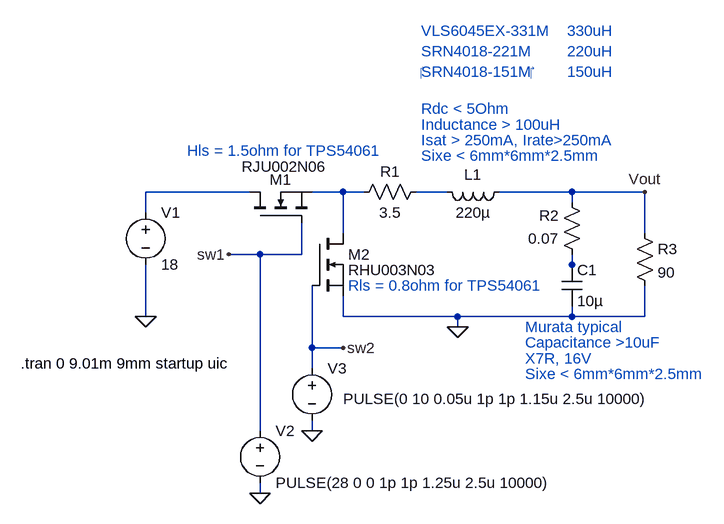
[diagram p0: schematic BuckConceptral.asc]
BuckConceptral.asc, the LTspice schematic file:
Version 4
SHEET 1 880 680
WIRE -160 112 -320 112
WIRE -16 112 -64 112
WIRE 16 112 -16 112
WIRE 144 112 96 112
WIRE 336 112 224 112
WIRE 448 112 336 112
WIRE 336 128 336 112
WIRE -320 144 -320 112
WIRE -16 176 -16 112
WIRE 448 176 448 112
WIRE -144 208 -192 208
WIRE -80 208 -80 160
WIRE -80 208 -144 208
WIRE 336 224 336 208
WIRE 336 240 336 224
WIRE -320 304 -320 224
WIRE -16 304 -16 272
WIRE 160 304 -16 304
WIRE 336 304 336 288
WIRE 336 304 160 304
WIRE 448 304 448 256
WIRE 448 304 336 304
WIRE 160 320 160 304
WIRE -64 352 -64 256
WIRE -16 352 -64 352
WIRE -64 384 -64 352
WIRE -144 480 -144 208
WIRE -64 480 -64 464
WIRE -144 576 -144 560
FLAG 160 320 0
FLAG -320 304 0
FLAG -144 576 0
FLAG -64 480 0
FLAG 448 112 Vout
FLAG -192 208 sw1
FLAG -16 352 sw2
SYMBOL ind 240 96 R90
WINDOW 0 5 56 VBottom 2
WINDOW 3 32 56 VTop 2
SYMATTR InstName L1
SYMATTR Value 220µ
SYMBOL cap 320 224 R0
SYMATTR InstName C1
SYMATTR Value 10µ
SYMBOL res 112 96 R90
WINDOW 0 0 56 VBottom 2
WINDOW 3 32 56 VTop 2
SYMATTR InstName R1
SYMATTR Value 3.5
SYMBOL res 352 224 R180
WINDOW 0 36 76 Left 2
WINDOW 3 36 40 Left 2
SYMATTR InstName R2
SYMATTR Value 0.07
SYMBOL res 432 160 R0
SYMATTR InstName R3
SYMATTR Value 90
SYMBOL voltage -320 128 R0
WINDOW 123 0 0 Left 2
WINDOW 39 0 0 Left 2
SYMATTR InstName V1
SYMATTR Value 18
SYMBOL nmos -64 176 R0
WINDOW 3 56 56 Left 2
SYMATTR Value RHU003N03
SYMATTR InstName M2
SYMBOL voltage -144 464 R0
WINDOW 123 0 0 Left 2
WINDOW 39 0 0 Left 2
SYMATTR InstName V2
SYMATTR Value PULSE(28 0 0 1p 1p 1.25u 2.5u 10000)
SYMBOL voltage -64 368 R0
WINDOW 3 48 63 Left 2
WINDOW 123 0 0 Left 2
WINDOW 39 0 0 Left 2
SYMATTR Value PULSE(0 10 0.05u 1p 1p 1.15u 2.5u 10000)
SYMATTR InstName V3
SYMBOL nmos -160 160 R270
WINDOW 0 67 31 VRight 2
WINDOW 3 87 119 VLeft 2
SYMATTR InstName M1
SYMATTR Value RJU002N06
TEXT -512 376 Left 2 !.tran 0 9.01m 9mm startup uic
TEXT 104 56 Left 2 ;Sixe < 6mm*6mm*2.5mm
TEXT 104 32 Left 2 ;Isat > 250mA, Irate>250mA
TEXT 104 8 Left 2 ;Inductance > 100uH
TEXT 104 -16 Left 2 ;Rdc < 5Ohm
TEXT 264 392 Left 2 ;Sixe < 6mm*6mm*2.5mm
TEXT 264 368 Left 2 ;X7R, 16V
TEXT 264 344 Left 2 ;Capacitance >10uF
TEXT 264 320 Left 2 ;Murata typical
TEXT -256 48 Left 2 ;Hls = 1.5ohm for TPS54061
TEXT -8 256 Left 2 ;Rls = 0.8ohm for TPS54061
TEXT 104 -136 Left 2 ;VLS6045EX-331M    330uH\nSRN4018-221M        220uH\n‎SRN4018-151M‎        150uH

The netlist it stands for:
* BuckConceptral.asc
L1 Vout N003 220µ
C1 N004 0 10µ
R1 N003 N002 3.5
R2 N004 Vout 0.07
R3 Vout 0 90
V1 N001 0 18
M2 N002 sw2 0 0 RHU003N03
V2 sw1 0 PULSE(28 0 0 1p 1p 1.25u 2.5u 10000)
V3 sw2 0 PULSE(0 10 0.05u 1p 1p 1.15u 2.5u 10000)
M1 N001 sw1 N002 N002 RJU002N06
.model NMOS NMOS
.model PMOS PMOS
.lib standard.mos
.tran 0 9.01m 9mm startup uic
* Sixe < 6mm*6mm*2.5mm
* Isat > 250mA, Irate>250mA
* Inductance > 100uH
* Rdc < 5Ohm
* Sixe < 6mm*6mm*2.5mm
* X7R, 16V
* Capacitance >10uF
* Murata typical
* Hls = 1.5ohm for TPS54061
* Rls = 0.8ohm for TPS54061
* VLS6045EX-331M    330uH
* SRN4018-221M        220uH
* ‎SRN4018-151M‎        150uH
.backanno
.end